# EasyEDA schematic diceee123_2021-04-25 (1).json
TITLE: Sheet_1; REV: 1.0; Date: 2021-04-25; Sheet: 1/1; Drawn By: PARIKSHIT; Company: Your Company
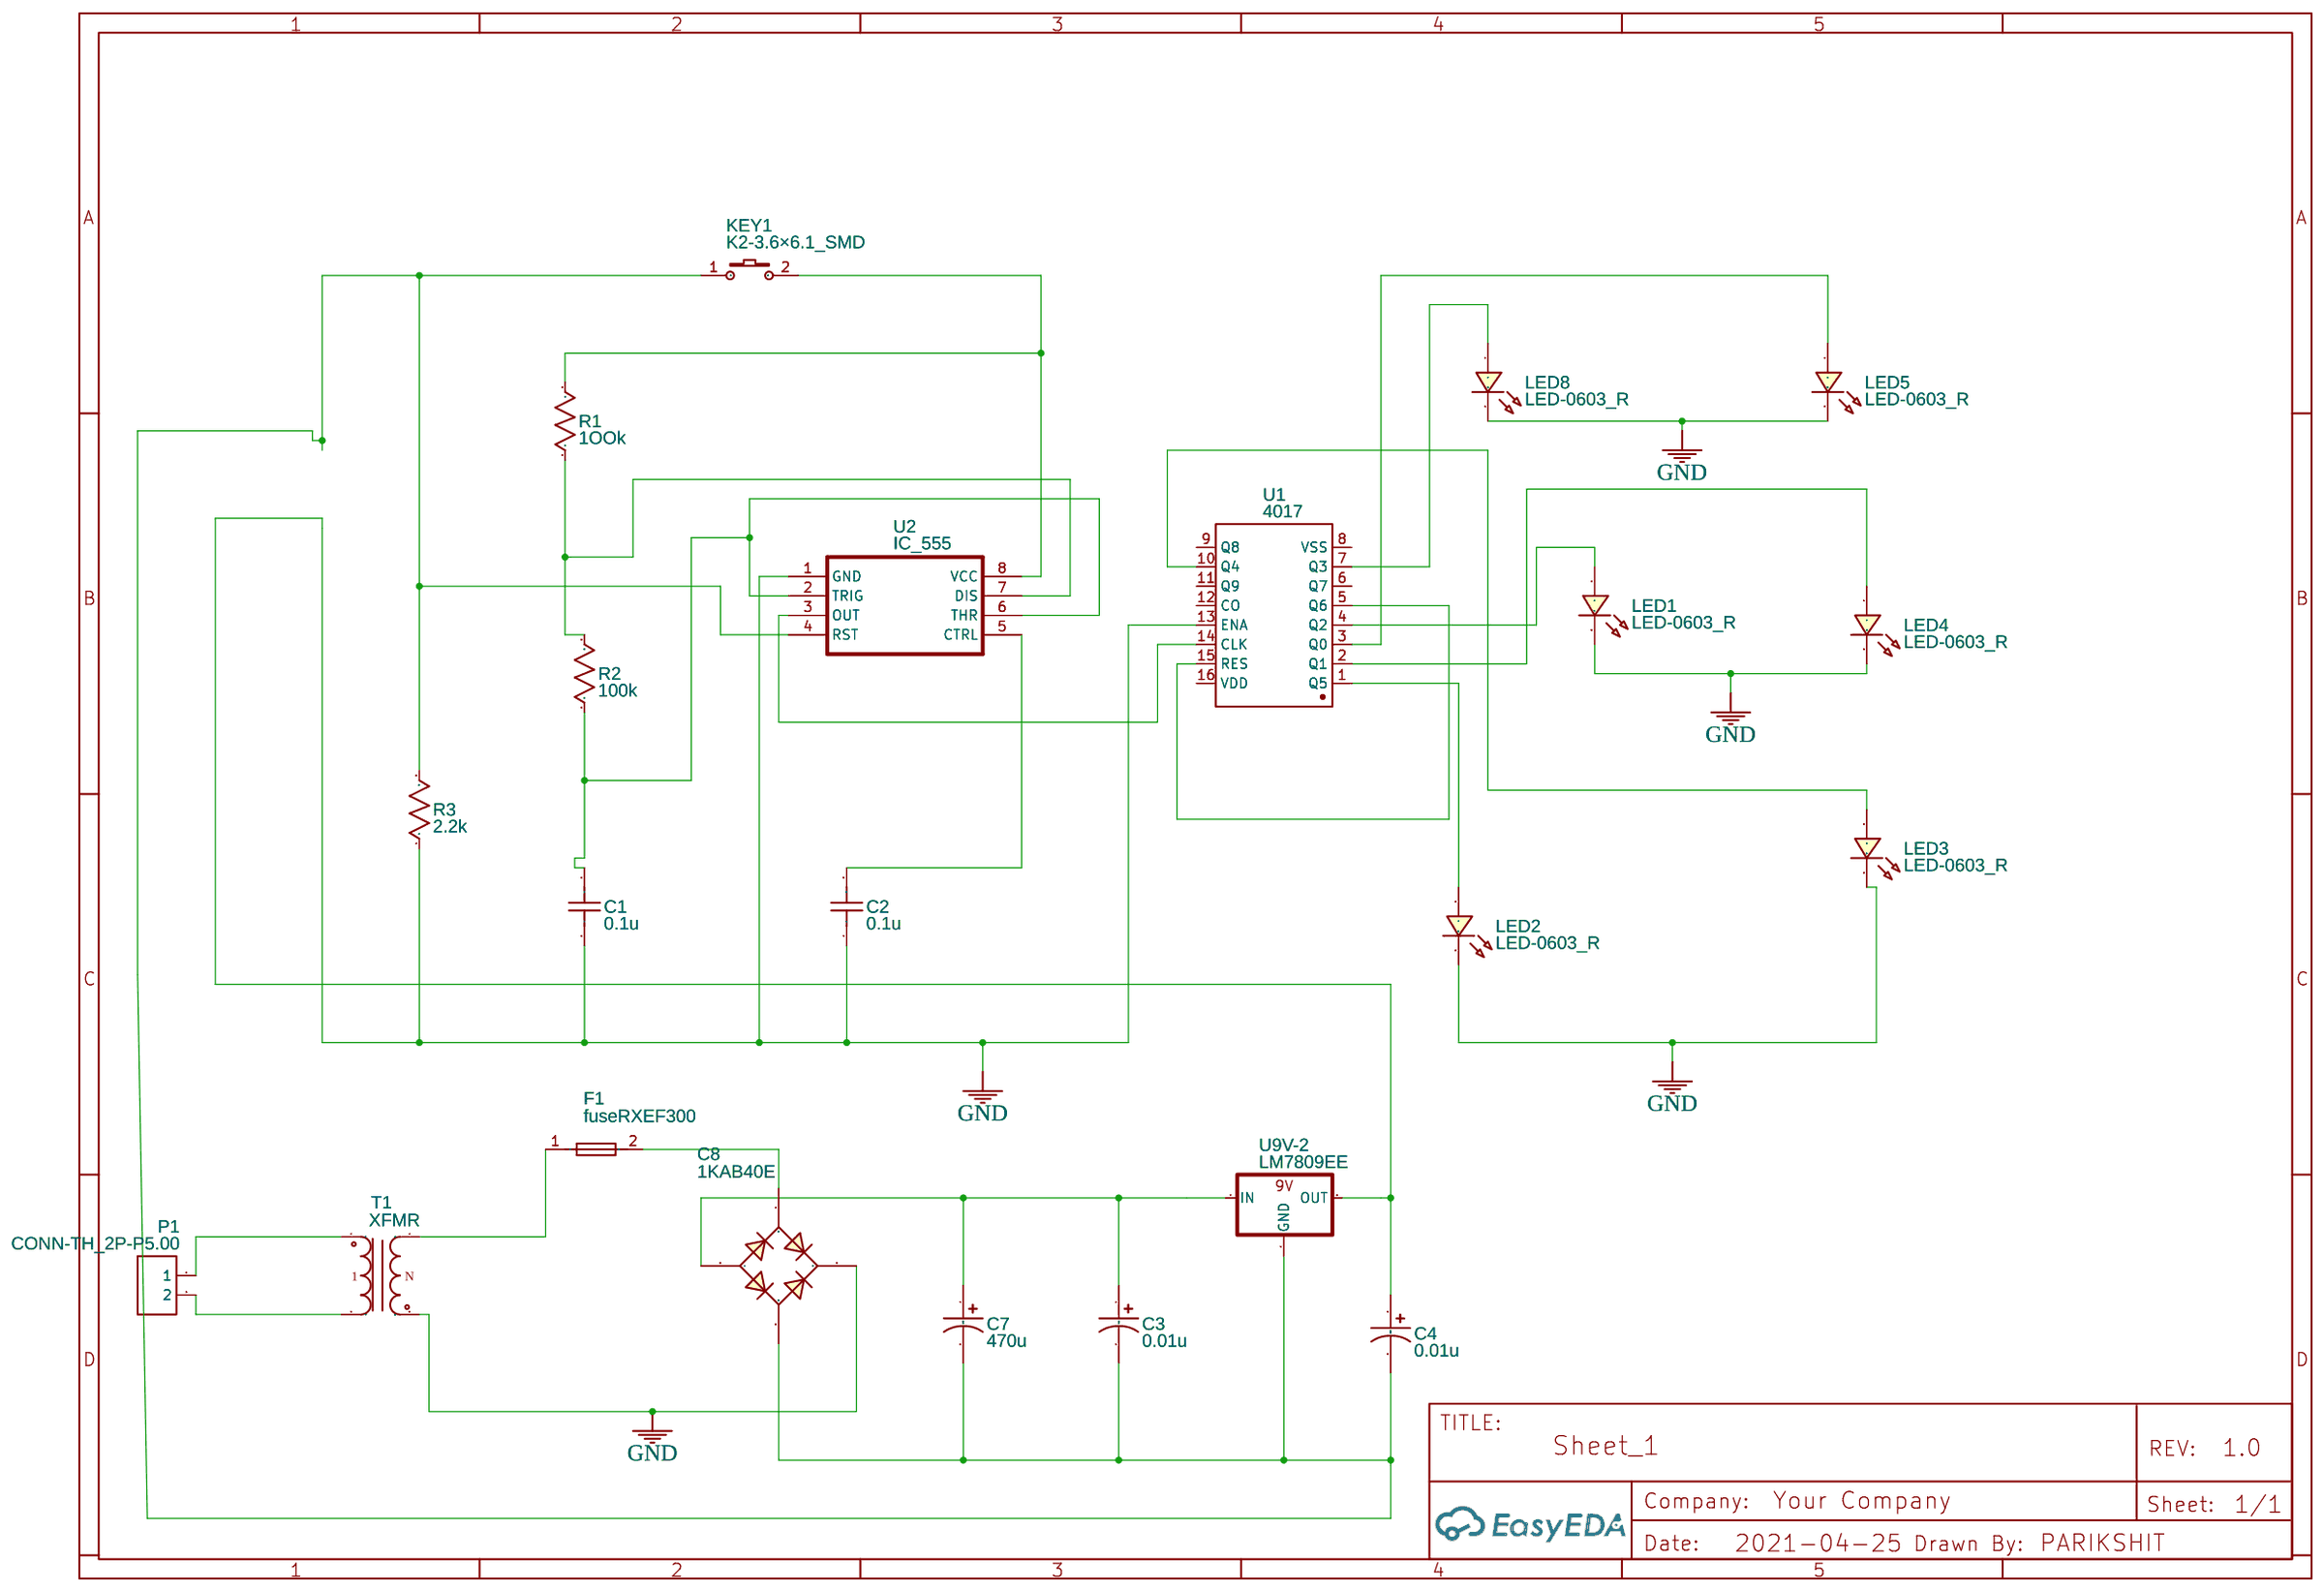
[diagram p0: schematic sheet]

## Parts
C1  0.1u  [C0603]
C2  0.1u  [C0603]
C3  0.01u  [CAP-D3.0×F1.5]
C4  0.01u  [CAP-D3.0×F1.5]
C7  470u  [CAP-D3.0×F1.5]
C8  1KAB40E  [D-38]
F1  fuseRXEF300  [FUSE-TH_L24.0-W3.0-P10.40-D1.2-S3.0]
KEY1  K2-3.6×6.1_SMD  [KEY-SMD_2P-L6.2-W3.6-LS8.0]
LED1  LED-0603_R  [LED0603_RED]
LED2  LED-0603_R  [LED0603_RED]
LED3  LED-0603_R  [LED0603_RED]
LED4  LED-0603_R  [LED0603_RED]
LED5  LED-0603_R  [LED0603_RED]
LED8  LED-0603_R  [LED0603_RED]
P1  CONN-TH_2P-P5.00  [CONN-TH_2P-P5.00]
R1  1OOk  [R0603]
R2  100k  [R0603]
R3  2.2k  [R0603]
T1  XFMR  [TRANSFORMER]
U1  4017  [DIP16]
U2  IC_555  [SOIC-8]
U9V-2  LM7809EE  [TO220]

## Library data of the parts
C1 C2 = C_0603_US: Contributor: LCEDA_Lib
C3 C4 C7 = CE_TH_D3.0×F1.5_US: Contributor: LCEDA_Lib
C8 = 1KAB40E: 1.2 Amp Rectifier Bridge
F1 = fuseRXEF300: Supplier: LCSC; Manufacturer: TE Connectivity; Supplier Part: C14397
KEY1 = K2-3.6×6.1_SMD: Supplier Part: C118141; Supplier: LCSC; Manufacturer Part: K2-1107ST-A4SW-06; Contributor: LCEDA_Lib; 制造商: 韩国韩荣
LED1-LED5 LED8 = LED-0603_R: Manufacturer: EVERLIGHT(台湾亿光); Manufacturer Part: 19-217/R6C-AL1M2VY/3T; Supplier Part: C72044; Supplier: LCSC; Contributor: LCEDA_01
P1 = CONN-TH_2P-P5.00: Supplier: LCSC; Contributor: LCEDA_Lib
R1-R3 = R_0603_US: Contributor: LCEDA_Lib
T1 = XFMR: RATIO: 1
U1 = 4017
U2 = IC_555: Contributor: DangerousPrototype
U9V-2 = 7809

## Nets
GND: C1.1 C2.1 C4.1 C8.1(K) LED1.2 LED2.2 LED3.2 LED4.2 LED5.2 LED8.2 R3.1 T1.3 U1.13(ENA) U2.1(GND) U9V-2.3(OUT)
Net-(C1-2): C1.2 R2.1 U2.2(TRIG) U2.6(THR)
Net-(C2-2): C2.2 U2.5(CTRL)
Net-(C3-1): C3.1 C7.1 C8.3(A) U9V-2.1(IN)
Net-(C3-2): C3.2 C4.2 C7.2 C8.2(C) KEY1.1 R3.2 U2.4(RST) U9V-2.2(GND)
Net-(C8-4): C8.4(C) F1.2
Net-(F1-1): F1.1 T1.4
Net-(KEY1-2): KEY1.2 R1.2 U2.8(VCC)
Net-(LED1-1): LED1.1 U1.4(Q2)
Net-(LED2-1): LED2.1 U1.1(Q5)
Net-(LED3-1): LED3.1 U1.10(Q4)
Net-(LED4-1): LED4.1 U1.2(Q1)
Net-(LED5-1): LED5.1 U1.3(Q0)
Net-(LED8-1): LED8.1 U1.7(Q3)
Net-(P1-1): P1.1 T1.1
Net-(P1-2): P1.2 T1.2
Net-(R1-1): R1.1 R2.2 U2.7(DIS)
Net-(U1-5): U1.5(Q6) U1.15(RES)
Net-(U1-14): U1.14(CLK) U2.3(OUT)

Not connected (* = marked no-connect by the designer): U1 6(Q7) 8(VSS) 9(Q8) 11(Q9) 12(CO) 16(VDD)
